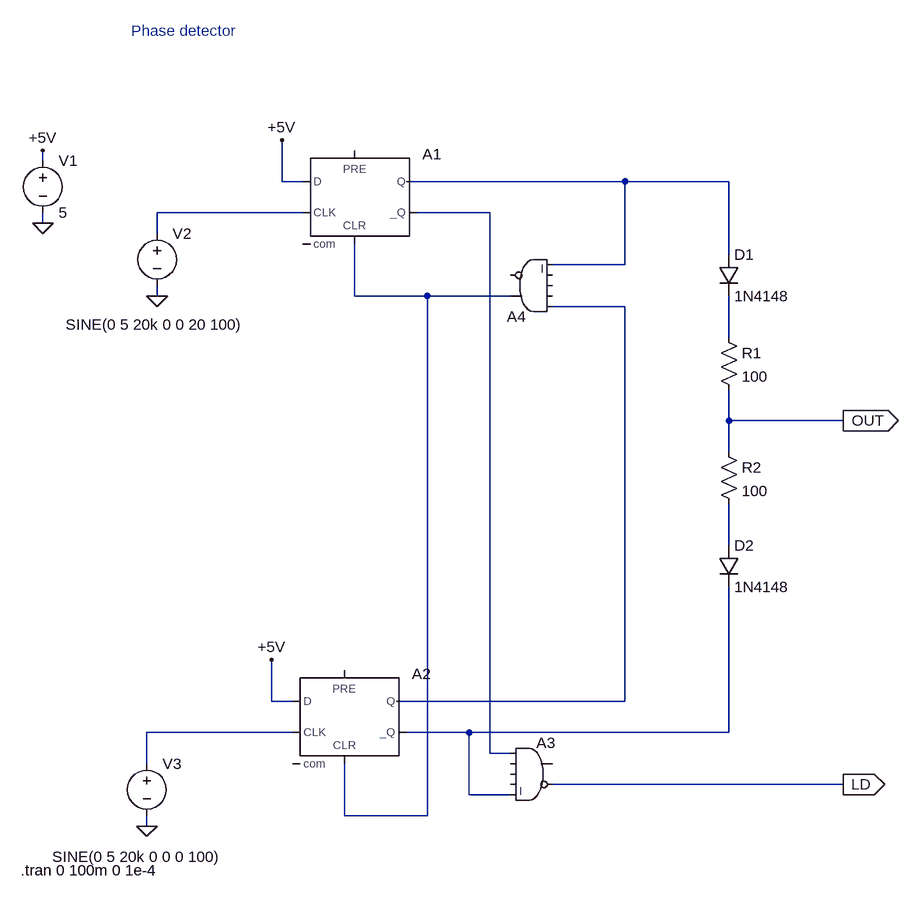
[diagram p0: schematic Phase_detector.asc]
Phase_detector.asc, the LTspice schematic file:
Version 4
SHEET 1 1100 1092
WIRE -240 -16 -240 -32
WIRE 128 16 128 -48
WIRE 160 16 128 16
WIRE 656 16 320 16
WIRE 816 16 656 16
WIRE 160 64 -64 64
WIRE 448 64 336 64
WIRE -240 80 -240 64
WIRE -64 96 -64 64
WIRE 816 128 816 16
WIRE 656 144 656 16
WIRE 656 144 544 144
WIRE -64 192 -64 176
WIRE 240 192 240 112
WIRE 352 192 240 192
WIRE 480 192 352 192
WIRE 656 208 544 208
WIRE 816 256 816 192
WIRE 816 384 816 336
WIRE 992 384 816 384
WIRE 816 432 816 384
WIRE 816 576 816 512
WIRE 112 816 112 752
WIRE 144 816 112 816
WIRE 656 816 656 208
WIRE 656 816 304 816
WIRE 144 864 -80 864
WIRE 416 864 320 864
WIRE 816 864 816 640
WIRE 816 864 416 864
WIRE 448 896 448 64
WIRE 480 896 448 896
WIRE -80 912 -80 864
WIRE 992 944 544 944
WIRE 416 960 416 864
WIRE 480 960 416 960
WIRE 224 992 224 912
WIRE 352 992 352 192
WIRE 352 992 224 992
WIRE -80 1008 -80 992
FLAG -240 80 0
FLAG -240 -32 +5V
FLAG 128 -48 +5V
FLAG 112 752 +5V
FLAG -64 192 0
FLAG -80 1008 0
FLAG 992 384 OUT
IOPIN 992 384 Out
FLAG 992 944 LD
IOPIN 992 944 Out
SYMBOL Digital\\dflop 240 -32 R0
SYMATTR InstName A1
SYMBOL Digital\\dflop 224 768 R0
SYMATTR InstName A2
SYMBOL Digital\\and 512 864 R0
SYMATTR InstName A3
SYMBOL Digital\\and 512 240 R180
SYMATTR InstName A4
SYMBOL res 800 240 R0
SYMATTR InstName R1
SYMATTR Value 100
SYMBOL res 800 416 R0
SYMATTR InstName R2
SYMATTR Value 100
SYMBOL diode 800 128 R0
SYMATTR InstName D1
SYMATTR Value 1N4148
SYMBOL diode 800 576 R0
SYMATTR InstName D2
SYMATTR Value 1N4148
SYMBOL voltage -240 -32 R0
WINDOW 123 0 0 Left 0
WINDOW 39 0 0 Left 0
SYMATTR InstName V1
SYMATTR Value 5
SYMBOL voltage -64 80 R0
WINDOW 3 -141 156 Left 2
WINDOW 123 0 0 Left 0
WINDOW 39 0 0 Left 0
SYMATTR InstName V2
SYMATTR Value SINE(0 5 20k 0 0 20 100)
SYMBOL voltage -80 896 R0
WINDOW 3 -146 159 Left 2
WINDOW 123 0 0 Left 0
WINDOW 39 0 0 Left 0
SYMATTR InstName V3
SYMATTR Value SINE(0 5 20k 0 0 0 100)
TEXT -104 -216 Left 2 ;Phase detector
TEXT -274 1076 Left 2 !.tran 0 100m 0 1e-4

The netlist it stands for:
* Phase_detector.asc
A1 +5V 0 N002 0 N004 N003 N001 0 DFLOP
A2 +5V 0 N008 0 N004 N009 N005 0 DFLOP
A3 N003 0 0 0 N009 LD 0 0 AND
A4 N005 0 0 0 N001 0 N004 0 AND
R1 N006 OUT 100
R2 OUT N007 100
D1 N001 N006 1N4148
D2 N007 N009 1N4148
V1 +5V 0 5
V2 N002 0 SINE(0 5 20k 0 0 20 100)
V3 N008 0 SINE(0 5 20k 0 0 0 100)
.model D D
.lib standard.dio
* Phase detector
.tran 0 100m 0 1e-4
.backanno
.end